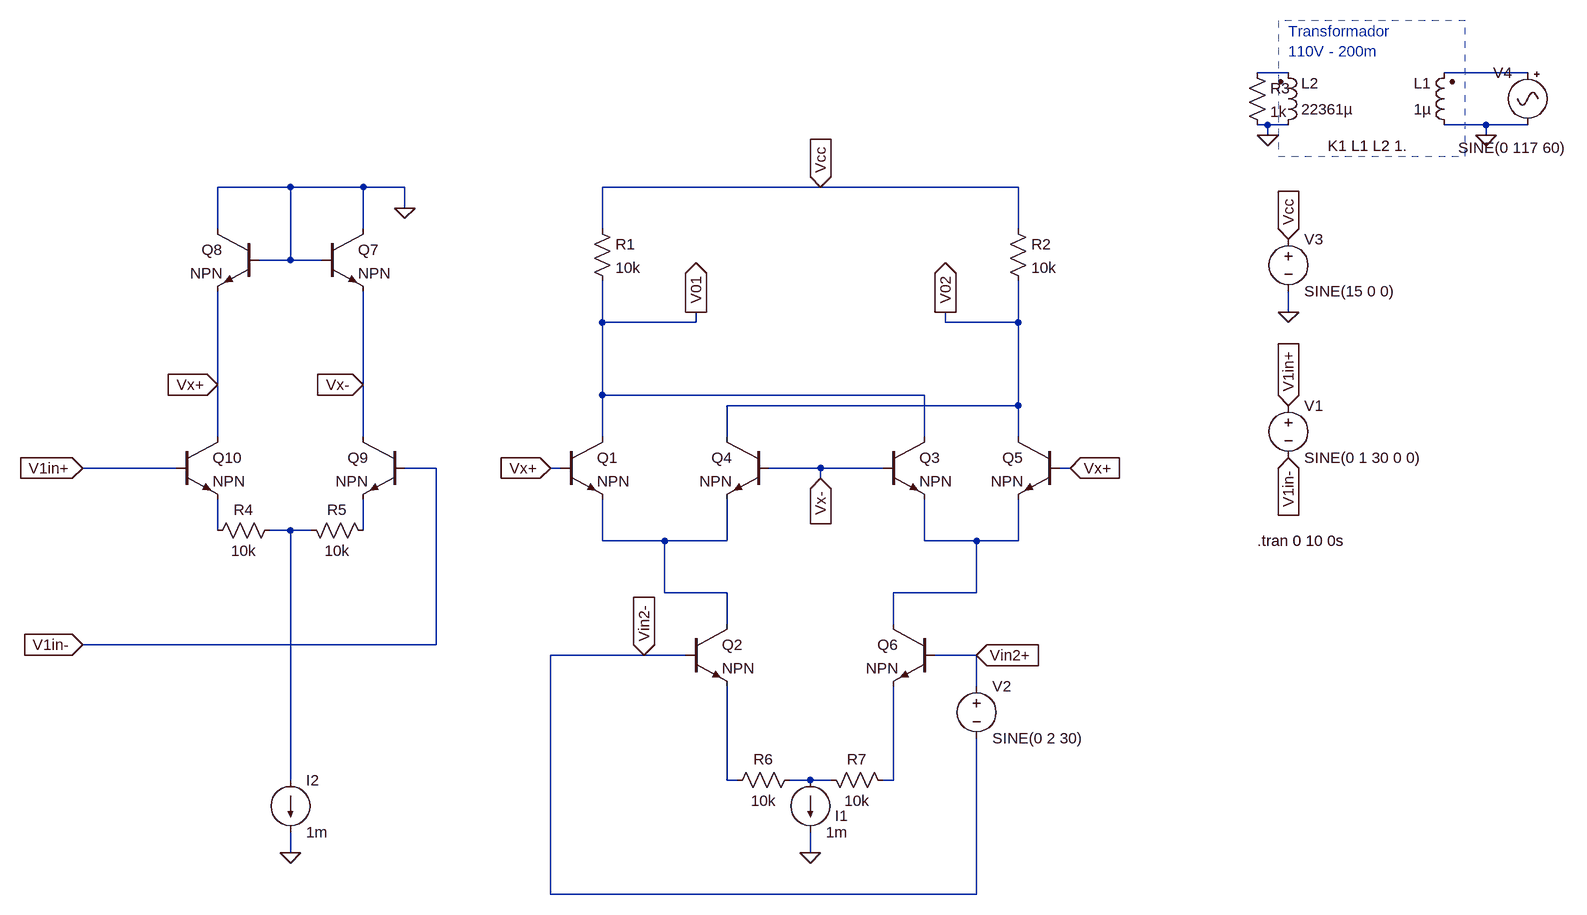
[diagram p0: schematic Medidor slide jader.asc]
Medidor slide jader.asc, the LTspice schematic file:
Version 4
SHEET 1 1264 788
WIRE 832 -496 784 -496
WIRE 1200 -496 1072 -496
WIRE 800 -416 784 -416
WIRE 832 -416 800 -416
WIRE 1136 -416 1072 -416
WIRE 1200 -416 1136 -416
WIRE 800 -400 800 -416
WIRE 1136 -400 1136 -416
WIRE -704 -320 -816 -320
WIRE -592 -320 -704 -320
WIRE -528 -320 -592 -320
WIRE 112 -320 -224 -320
WIRE 416 -320 112 -320
WIRE -528 -288 -528 -320
WIRE -816 -256 -816 -320
WIRE -592 -256 -592 -320
WIRE -224 -256 -224 -320
WIRE 416 -256 416 -320
WIRE -704 -208 -704 -320
WIRE -704 -208 -752 -208
WIRE -656 -208 -704 -208
WIRE 832 -128 832 -160
WIRE -224 -112 -224 -176
WIRE -80 -112 -80 -128
WIRE -80 -112 -224 -112
WIRE 304 -112 304 -128
WIRE 416 -112 416 -176
WIRE 416 -112 304 -112
WIRE -816 -16 -816 -160
WIRE -592 -16 -592 -160
WIRE -224 0 -224 -112
WIRE 272 0 -224 0
WIRE 416 16 416 -112
WIRE 416 16 -32 16
WIRE -816 64 -816 -16
WIRE -592 64 -592 -16
WIRE -224 64 -224 0
WIRE -32 64 -32 16
WIRE 272 64 272 0
WIRE 416 64 416 16
WIRE -880 112 -1024 112
WIRE -480 112 -528 112
WIRE -288 112 -304 112
WIRE 112 112 32 112
WIRE 208 112 112 112
WIRE 496 112 480 112
WIRE 112 128 112 112
WIRE -816 208 -816 160
WIRE -704 208 -736 208
WIRE -672 208 -704 208
WIRE -592 208 -592 160
WIRE -224 224 -224 160
WIRE -128 224 -224 224
WIRE -32 224 -32 160
WIRE -32 224 -128 224
WIRE 272 224 272 160
WIRE 352 224 272 224
WIRE 416 224 416 160
WIRE 416 224 352 224
WIRE -128 304 -128 224
WIRE -32 304 -128 304
WIRE 352 304 352 224
WIRE 352 304 224 304
WIRE -32 352 -32 304
WIRE 224 352 224 304
WIRE -480 384 -480 112
WIRE -480 384 -1024 384
WIRE -160 400 -304 400
WIRE -96 400 -160 400
WIRE 352 400 288 400
WIRE 352 448 352 400
WIRE -704 592 -704 208
WIRE -32 592 -32 448
WIRE -16 592 -32 592
WIRE 96 592 64 592
WIRE 128 592 96 592
WIRE 224 592 224 448
WIRE 224 592 208 592
WIRE -704 704 -704 672
WIRE 96 704 96 672
WIRE -304 768 -304 400
WIRE 352 768 352 528
WIRE 352 768 -304 768
FLAG 96 704 0
FLAG 832 96 V1in-
IOPIN 832 96 In
FLAG 832 16 V1in+
IOPIN 832 16 In
FLAG 112 -320 Vcc
IOPIN 112 -320 In
FLAG 832 -240 Vcc
IOPIN 832 -240 In
FLAG 832 -128 0
FLAG 352 400 Vin2+
IOPIN 352 400 In
FLAG -160 400 Vin2-
IOPIN -160 400 In
FLAG -80 -128 V01
IOPIN -80 -128 Out
FLAG 304 -128 V02
IOPIN 304 -128 Out
FLAG 1136 -400 0
FLAG 800 -400 0
FLAG -528 -288 0
FLAG -704 704 0
FLAG -592 -16 Vx-
IOPIN -592 -16 In
FLAG -816 -16 Vx+
IOPIN -816 -16 In
FLAG -1024 112 V1in+
IOPIN -1024 112 In
FLAG -1024 384 V1in-
IOPIN -1024 384 In
FLAG -304 112 Vx+
IOPIN -304 112 In
FLAG 496 112 Vx+
IOPIN 496 112 In
FLAG 112 128 Vx-
IOPIN 112 128 In
SYMBOL voltage 832 0 R0
WINDOW 123 0 0 Left 2
WINDOW 39 0 0 Left 2
SYMATTR InstName V1
SYMATTR Value SINE(0 1 30 0 0)
SYMBOL voltage 352 432 R0
WINDOW 123 0 0 Left 2
WINDOW 39 0 0 Left 2
SYMATTR InstName V2
SYMATTR Value SINE(0 2 30)
SYMBOL npn -288 64 R0
SYMATTR InstName Q1
SYMBOL npn -96 352 R0
SYMATTR InstName Q2
SYMBOL npn 208 64 R0
SYMATTR InstName Q3
SYMBOL npn 32 64 M0
SYMATTR InstName Q4
SYMBOL npn 480 64 M0
SYMATTR InstName Q5
SYMBOL npn 288 352 M0
SYMATTR InstName Q6
SYMBOL current 96 592 R0
WINDOW 123 0 0 Left 2
WINDOW 39 0 0 Left 2
WINDOW 0 38 55 Left 2
SYMATTR InstName I1
SYMATTR Value 1m
SYMBOL voltage 832 -256 R0
WINDOW 123 0 0 Left 2
WINDOW 39 0 0 Left 2
SYMATTR InstName V3
SYMATTR Value SINE(15 0 0)
SYMBOL res -240 -272 R0
SYMATTR InstName R1
SYMATTR Value 10k
SYMBOL res 400 -272 R0
SYMATTR InstName R2
SYMATTR Value 10k
SYMBOL ind2 1088 -400 R180
WINDOW 0 36 80 Left 2
WINDOW 3 36 40 Left 2
SYMATTR InstName L1
SYMATTR Value 1µ
SYMATTR SpiceLine Rser=100
SYMBOL ind2 816 -400 M180
WINDOW 0 36 80 Left 2
WINDOW 3 36 40 Left 2
SYMATTR InstName L2
SYMATTR Value 22361µ
SYMATTR SpiceLine Rser=100
SYMBOL Misc\\signal 1200 -512 M0
WINDOW 3 -60 131 Left 2
WINDOW 123 0 0 Left 2
WINDOW 39 0 0 Left 2
SYMATTR Value SINE(0 117 60)
SYMATTR InstName V4
SYMBOL res 768 -512 R0
SYMATTR InstName R3
SYMATTR Value 1k
SYMBOL npn -656 -256 R0
SYMATTR InstName Q7
SYMBOL npn -752 -256 M0
SYMATTR InstName Q8
SYMBOL npn -528 64 M0
SYMATTR InstName Q9
SYMBOL npn -880 64 R0
SYMATTR InstName Q10
SYMBOL res -720 192 R90
WINDOW 0 0 56 VBottom 2
WINDOW 3 32 56 VTop 2
SYMATTR InstName R4
SYMATTR Value 10k
SYMBOL res -688 192 M90
WINDOW 0 0 56 VBottom 2
WINDOW 3 32 56 VTop 2
SYMATTR InstName R5
SYMATTR Value 10k
SYMBOL current -704 592 R0
WINDOW 123 0 0 Left 2
WINDOW 39 0 0 Left 2
SYMATTR InstName I2
SYMATTR Value 1m
SYMBOL res 80 576 R90
WINDOW 0 0 56 VBottom 2
WINDOW 3 32 56 VTop 2
SYMATTR InstName R6
SYMATTR Value 10k
SYMBOL res 112 576 M90
WINDOW 0 0 56 VBottom 2
WINDOW 3 32 56 VTop 2
SYMATTR InstName R7
SYMATTR Value 10k
TEXT 1016 -384 Right 2 !K1 L1 L2 1.
TEXT 832 -560 Left 2 ;Transformador \n110V - 200m
TEXT 784 224 Left 2 !.tran 0 10 0s
LINE Normal 1104 -368 1104 -576 2
LINE Normal 816 -368 1104 -368 2
LINE Normal 816 -576 816 -368 2
LINE Normal 1104 -576 816 -576 2

The netlist it stands for:
* Medidor slide jader.asc
V1 V1in+ V1in- SINE(0 1 30 0 0)
V2 Vin2+ Vin2- SINE(0 2 30)
Q1 V01 Vx+ N006 0 NPN
Q2 N006 Vin2- N008 0 NPN
Q3 V01 Vx- N007 0 NPN
Q4 V02 Vx- N006 0 NPN
Q5 V02 Vx+ N007 0 NPN
Q6 N007 Vin2+ N010 0 NPN
I1 N009 0 1m
V3 Vcc 0 SINE(15 0 0)
R1 Vcc V01 10k
R2 Vcc V02 10k
L1 0 N002 1µ Rser=100
L2 0 N001 22361µ Rser=100
V4 N002 0 SINE(0 117 60)
R3 N001 0 1k
Q7 0 0 Vx- 0 NPN
Q8 0 0 Vx+ 0 NPN
Q9 Vx- V1in- N005 0 NPN
Q10 Vx+ V1in+ N003 0 NPN
R4 N004 N003 10k
R5 N004 N005 10k
I2 N004 0 1m
R6 N009 N008 10k
R7 N009 N010 10k
.model NPN NPN
.model PNP PNP
.lib standard.bjt
K1 L1 L2 1.
* Transformador
* 110V - 200m
.tran 0 10 0s
.backanno
.end